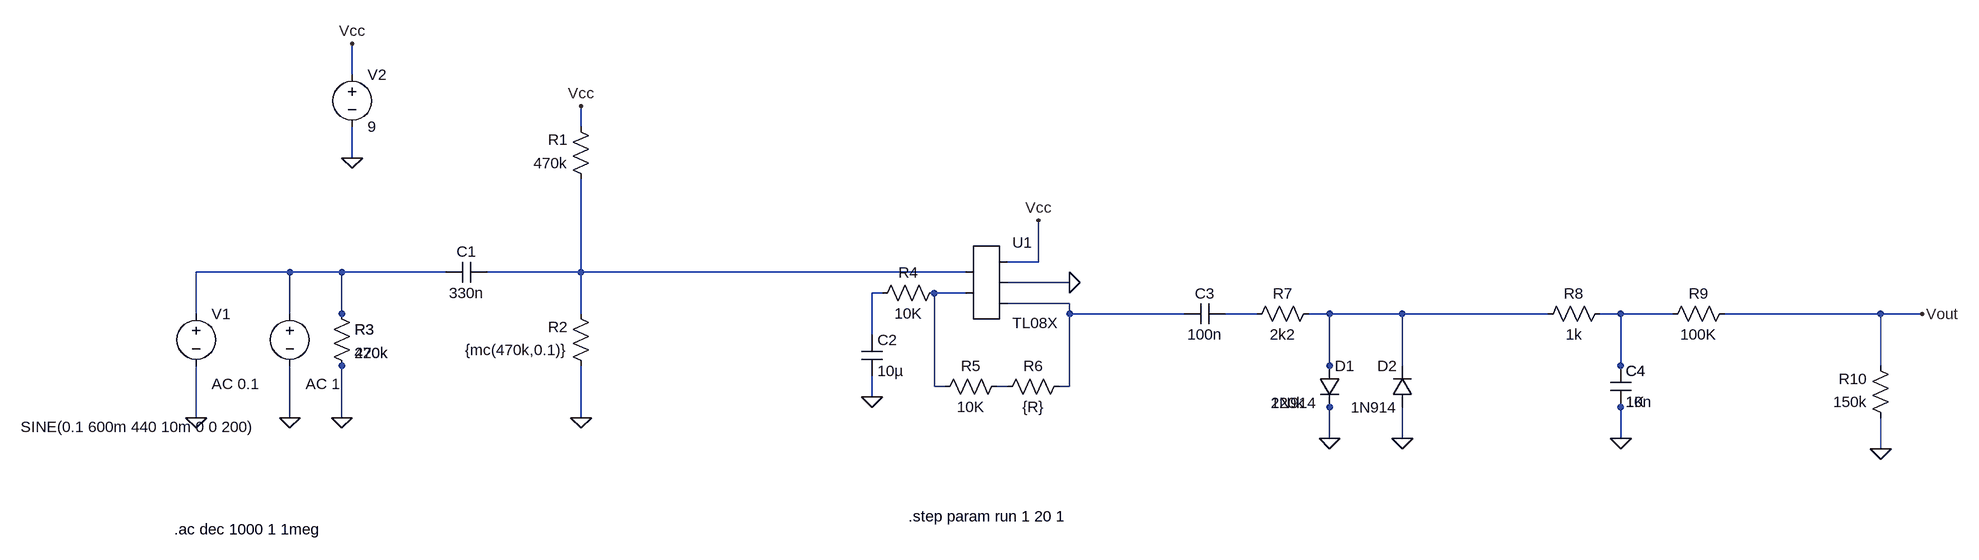
[diagram p0: schematic WholeThing.asc]
WholeThing.asc, the LTspice schematic file:
Version 4
<<<<<<< HEAD
SHEET 1 1928 924
=======
SHEET 1 1928 804
>>>>>>> 1d85ddbf02455113f7b6df75f140ffc9527a46ae
WIRE -560 208 -560 160
WIRE -208 288 -208 256
WIRE -560 336 -560 288
WIRE 496 496 496 432
WIRE 496 496 448 496
<<<<<<< HEAD
WIRE -576 512 -656 512
=======
WIRE -576 512 -800 512
>>>>>>> 1d85ddbf02455113f7b6df75f140ffc9527a46ae
WIRE -416 512 -576 512
WIRE -208 512 -208 368
WIRE -208 512 -352 512
WIRE 384 512 -208 512
WIRE 544 528 448 528
WIRE 256 544 240 544
WIRE 384 544 336 544
WIRE 544 560 448 560
<<<<<<< HEAD
WIRE -656 576 -656 512
=======
WIRE -800 576 -800 512
>>>>>>> 1d85ddbf02455113f7b6df75f140ffc9527a46ae
WIRE -576 576 -576 512
WIRE -208 576 -208 512
WIRE 544 576 544 560
WIRE 720 576 544 576
WIRE 832 576 784 576
WIRE 944 576 912 576
WIRE 1056 576 944 576
WIRE 1280 576 1056 576
WIRE 1392 576 1360 576
WIRE 1472 576 1392 576
WIRE 1792 576 1552 576
WIRE 1856 576 1792 576
WIRE 240 608 240 544
WIRE 944 656 944 576
WIRE 1056 656 1056 576
WIRE 1392 656 1392 576
WIRE 1792 656 1792 576
WIRE 336 688 336 544
WIRE 352 688 336 688
WIRE 448 688 432 688
WIRE 544 688 544 576
WIRE 544 688 528 688
WIRE 240 704 240 672
<<<<<<< HEAD
WIRE -656 736 -656 656
=======
WIRE -800 736 -800 656
>>>>>>> 1d85ddbf02455113f7b6df75f140ffc9527a46ae
WIRE -576 736 -576 656
WIRE -208 736 -208 656
WIRE 944 768 944 720
WIRE 1056 768 1056 720
WIRE 1392 768 1392 720
WIRE 1792 784 1792 736
FLAG -576 736 0
<<<<<<< HEAD
FLAG -656 736 0
=======
FLAG -800 736 0
>>>>>>> 1d85ddbf02455113f7b6df75f140ffc9527a46ae
FLAG -208 736 0
FLAG -208 256 Vcc
FLAG -560 160 Vcc
FLAG -560 336 0
FLAG 240 704 0
FLAG 496 432 Vcc
FLAG 544 528 0
FLAG 944 768 0
FLAG 1056 768 0
FLAG 1392 768 0
FLAG 1792 784 0
FLAG 1856 576 Vout
SYMBOL res -192 384 R180
WINDOW 0 36 76 Left 2
WINDOW 3 36 40 Left 2
SYMATTR InstName R1
<<<<<<< HEAD
SYMATTR Value {mc(470k,0.1)}
=======
SYMATTR Value 470k
>>>>>>> 1d85ddbf02455113f7b6df75f140ffc9527a46ae
SYMBOL res -192 672 R180
WINDOW 0 36 76 Left 2
WINDOW 3 36 40 Left 2
SYMATTR InstName R2
<<<<<<< HEAD
SYMATTR Value {mc(470k,0.1)}
SYMBOL res -592 560 R0
SYMATTR InstName R3
SYMATTR Value {mc(220k,0.1)}
=======
SYMATTR Value 470k
SYMBOL res -592 560 R0
SYMATTR InstName R3
SYMATTR Value 220k
>>>>>>> 1d85ddbf02455113f7b6df75f140ffc9527a46ae
SYMBOL cap -352 496 R90
WINDOW 0 0 32 VBottom 2
WINDOW 3 32 32 VTop 2
SYMATTR InstName C1
SYMATTR Value 330n
<<<<<<< HEAD
SYMBOL voltage -656 560 R0
WINDOW 3 -270 190 Left 2
WINDOW 123 24 124 Left 2
WINDOW 39 0 0 Left 0
SYMATTR Value ""
SYMATTR Value2 AC 1
=======
SYMBOL voltage -800 560 R0
WINDOW 3 -270 190 Left 2
WINDOW 123 24 124 Left 2
WINDOW 39 0 0 Left 0
SYMATTR Value SINE(0.1 600m 440 10m 0 0 200)
SYMATTR Value2 AC 0.1
>>>>>>> 1d85ddbf02455113f7b6df75f140ffc9527a46ae
SYMATTR InstName V1
SYMBOL voltage -560 192 R0
WINDOW 123 0 0 Left 0
WINDOW 39 0 0 Left 0
SYMATTR InstName V2
SYMATTR Value 9
SYMBOL res 352 528 R90
WINDOW 0 0 56 VBottom 2
WINDOW 3 32 56 VTop 2
SYMATTR InstName R4
SYMATTR Value 10K
SYMBOL res 448 672 R90
WINDOW 0 0 56 VBottom 2
WINDOW 3 32 56 VTop 2
SYMATTR InstName R5
<<<<<<< HEAD
SYMATTR Value 10k
=======
SYMATTR Value 10K
>>>>>>> 1d85ddbf02455113f7b6df75f140ffc9527a46ae
SYMBOL AutoGenerated\\TL08X 416 528 R0
SYMATTR InstName U1
SYMBOL res 544 672 R90
WINDOW 0 0 56 VBottom 2
WINDOW 3 32 56 VTop 2
SYMATTR InstName R6
<<<<<<< HEAD
SYMATTR Value 200k
=======
SYMATTR Value {R}
>>>>>>> 1d85ddbf02455113f7b6df75f140ffc9527a46ae
SYMBOL cap 224 608 R0
SYMATTR InstName C2
SYMATTR Value 10µ
SYMBOL cap 784 560 R90
WINDOW 0 0 32 VBottom 2
WINDOW 3 32 32 VTop 2
SYMATTR InstName C3
<<<<<<< HEAD
SYMATTR Value 1µ
=======
SYMATTR Value 100n
>>>>>>> 1d85ddbf02455113f7b6df75f140ffc9527a46ae
SYMBOL res 928 560 R90
WINDOW 0 0 56 VBottom 2
WINDOW 3 32 56 VTop 2
SYMATTR InstName R7
<<<<<<< HEAD
SYMATTR Value 2k2
SYMBOL diode 928 656 R0
WINDOW 3 -74 57 Left 2
SYMATTR Value 1N4148
=======
SYMATTR Value 220k
SYMBOL diode 928 656 R0
WINDOW 3 -74 57 Left 2
SYMATTR Value 1N914
>>>>>>> 1d85ddbf02455113f7b6df75f140ffc9527a46ae
SYMATTR InstName D1
SYMBOL diode 1072 720 R180
WINDOW 0 24 64 Left 2
WINDOW 3 24 0 Left 2
SYMATTR InstName D2
<<<<<<< HEAD
SYMATTR Value 1N4148
=======
SYMATTR Value 1N914
>>>>>>> 1d85ddbf02455113f7b6df75f140ffc9527a46ae
SYMBOL res 1376 560 R90
WINDOW 0 0 56 VBottom 2
WINDOW 3 32 56 VTop 2
SYMATTR InstName R8
<<<<<<< HEAD
SYMATTR Value 1k
SYMBOL cap 1376 656 R0
SYMATTR InstName C4
SYMATTR Value {mc(10n,0.1)}
=======
SYMATTR Value 1K
SYMBOL cap 1376 656 R0
SYMATTR InstName C4
SYMATTR Value 10n
>>>>>>> 1d85ddbf02455113f7b6df75f140ffc9527a46ae
SYMBOL res 1568 560 R90
WINDOW 0 0 56 VBottom 2
WINDOW 3 32 56 VTop 2
SYMATTR InstName R9
<<<<<<< HEAD
SYMATTR Value 0
=======
SYMATTR Value 100K
>>>>>>> 1d85ddbf02455113f7b6df75f140ffc9527a46ae
SYMBOL res 1808 752 R180
WINDOW 0 36 76 Left 2
WINDOW 3 36 40 Left 2
SYMATTR InstName R10
<<<<<<< HEAD
SYMATTR Value 250k
TEXT 296 888 Left 2 !.step param run 1 20 1
TEXT -834 908 Left 2 !.ac dec 1000 1 1meg
=======
SYMATTR Value 150k
>>>>>>> 1d85ddbf02455113f7b6df75f140ffc9527a46ae

The netlist it stands for:
* WholeThing.asc
R1 N002 Vcc 470k
R2 0 N002 {mc(470k,0.1)}
R3 N001 0 470k
R3 N001 0 220k
C1 N002 N001 330n
V§? N001 0 AC 1
V1 N001 0 SINE(0.1 600m 440 10m 0 0 200) AC 0.1
V2 Vcc 0 9
R4 N004 N003 10K
R5 N009 N004 10K
* U1: TL08X (symbol AutoGenerated\TL08X not available, pins judged from their places): pin1=N002 pin2=N004 pin3=Vcc pin4=0 pin5=N005
R6 N005 N009 {R}
C2 N003 0 10µ
C3 N006 N005 100n
R7 N007 N006 2k2
D§? N007 0 220k
D1 N007 0 1N914
D2 0 N007 1N914
R8 N008 N007 1k
C4 N008 0 1K
C4 N008 0 10n
R9 Vout N008 100K
R10 0 Vout 150k
.model D D
.lib standard.dio
.step param run 1 20 1
.ac dec 1000 1 1meg
.backanno
.end